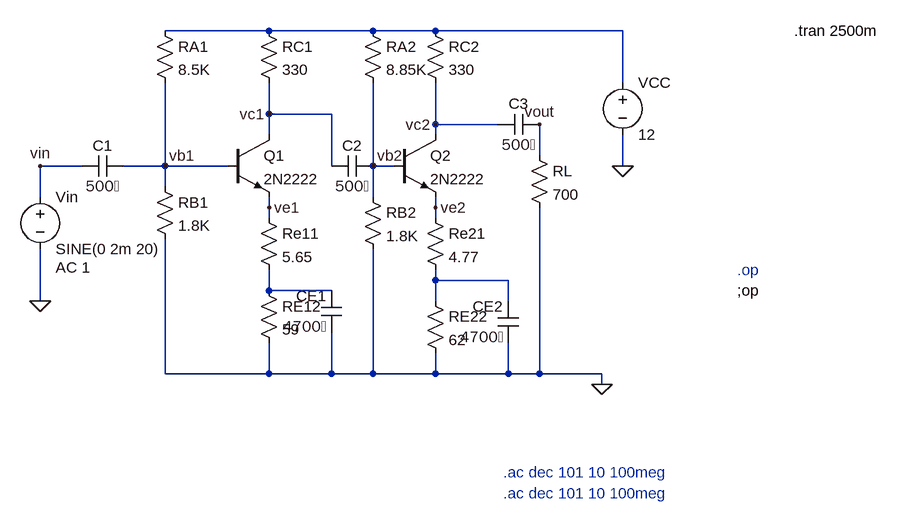
[diagram p0: schematic Draft3.asc]
Draft3.asc, the LTspice schematic file:
Version 4.1
SHEET 1 1200 680
WIRE 224 -48 64 -48
WIRE 384 -48 224 -48
WIRE 480 -48 384 -48
WIRE 768 -48 480 -48
WIRE 768 32 768 -48
WIRE 224 80 224 32
WIRE 320 80 224 80
WIRE 480 96 480 32
WIRE 576 96 480 96
WIRE 224 112 224 80
WIRE 480 112 480 96
WIRE 640 144 640 96
WIRE -64 160 -128 160
WIRE 64 160 64 32
WIRE 64 160 0 160
WIRE 160 160 64 160
WIRE 320 160 320 80
WIRE 384 160 384 32
WIRE 416 160 384 160
WIRE 768 160 768 112
WIRE 64 192 64 160
WIRE -128 208 -128 160
WIRE 384 208 384 160
WIRE 224 224 224 208
WIRE 480 224 480 208
WIRE 224 240 224 224
WIRE 480 240 480 224
WIRE 480 336 480 320
WIRE 592 336 480 336
WIRE 224 352 224 320
WIRE 320 352 224 352
WIRE -128 368 -128 288
WIRE 480 368 480 336
WIRE 592 368 592 336
WIRE 64 480 64 272
WIRE 224 480 224 432
WIRE 224 480 64 480
WIRE 320 480 320 416
WIRE 320 480 224 480
WIRE 384 480 384 288
WIRE 384 480 320 480
WIRE 480 480 480 448
WIRE 480 480 384 480
WIRE 592 480 592 432
WIRE 592 480 480 480
WIRE 640 480 640 224
WIRE 640 480 592 480
WIRE 736 480 640 480
WIRE 736 496 736 480
FLAG 768 160 0
FLAG 736 496 0
FLAG -128 368 0
FLAG 480 224 ve2
FLAG 480 96 vc2
FLAG 224 80 vc1
FLAG 224 224 ve1
FLAG 384 160 vb2
FLAG 64 160 vb1
FLAG -128 160 vin
FLAG 640 96 vout
SYMBOL npn 160 112 R0
SYMATTR InstName Q1
SYMATTR Value 2N2222
SYMBOL res 208 -64 R0
SYMATTR InstName RC1
SYMATTR Value 330
SYMBOL res 208 224 R0
SYMATTR InstName Re11
SYMATTR Value 5.65
SYMBOL res 208 336 R0
SYMATTR InstName RE12
SYMATTR Value 59
SYMBOL res 48 176 R0
SYMATTR InstName RB1
SYMATTR Value 1.8K
SYMBOL res 48 -64 R0
SYMATTR InstName RA1
SYMATTR Value 8.5K
SYMBOL res 368 -64 R0
SYMATTR InstName RA2
SYMATTR Value 8.85K
SYMBOL res 368 192 R0
SYMATTR InstName RB2
SYMATTR Value 1.8K
SYMBOL npn 416 112 R0
SYMATTR InstName Q2
SYMATTR Value 2N2222
SYMBOL res 464 -64 R0
SYMATTR InstName RC2
SYMATTR Value 330
SYMBOL res 464 224 R0
SYMATTR InstName Re21
SYMATTR Value 4.77
SYMBOL res 464 352 R0
SYMATTR InstName RE22
SYMATTR Value 62
SYMBOL cap 384 144 R90
WINDOW 0 0 32 VBottom 2
WINDOW 3 32 32 VTop 2
SYMATTR InstName C2
SYMATTR Value 500�
SYMBOL cap 640 80 R90
WINDOW 0 0 32 VBottom 2
WINDOW 3 32 32 VTop 2
SYMATTR InstName C3
SYMATTR Value 500�
SYMBOL cap 608 432 R180
WINDOW 0 24 56 Left 2
WINDOW 3 24 8 Left 2
SYMATTR InstName CE2
SYMATTR Value 4700�
SYMBOL cap 336 416 R180
WINDOW 0 24 56 Left 2
WINDOW 3 24 8 Left 2
SYMATTR InstName CE1
SYMATTR Value 4700�
SYMBOL cap -64 176 R270
WINDOW 0 32 32 VTop 2
WINDOW 3 0 32 VBottom 2
SYMATTR InstName C1
SYMATTR Value 500�
SYMBOL res 624 128 R0
SYMATTR InstName RL
SYMATTR Value 700
SYMBOL voltage 768 16 R0
SYMATTR InstName VCC
SYMATTR Value 12
SYMBOL voltage -128 192 R0
WINDOW 123 24 124 Left 2
WINDOW 39 0 0 Left 0
SYMATTR Value2 AC 1
SYMATTR InstName Vin
SYMATTR Value SINE(0 2m 20)
TEXT 584 632 Left 2 ;.ac dec 101 10 100meg
TEXT 944 320 Left 2 ;.op
TEXT 584 664 Left 2 ;.ac dec 101 10 100meg
TEXT 944 352 Left 2 !;op
TEXT 1032 -48 Left 2 !.tran 2500m

The netlist it stands for:
* Draft3.asc
Q1 vc1 vb1 ve1 0 2N2222
RC1 N001 vc1 330
Re11 ve1 N003 5.65
RE12 N003 0 59
RB1 vb1 0 1.8K
RA1 N001 vb1 8.5K
RA2 N001 vb2 8.85K
RB2 vb2 0 1.8K
Q2 vc2 vb2 ve2 0 2N2222
RC2 N001 vc2 330
Re21 ve2 N002 4.77
RE22 N002 0 62
C2 vb2 vc1 500�
C3 vout vc2 500�
CE2 0 N002 4700�
CE1 0 N003 4700�
C1 vin vb1 500�
RL vout 0 700
VCC N001 0 12
Vin vin 0 SINE(0 2m 20) AC 1
.model NPN NPN
.model PNP PNP
.lib standard.bjt
* .ac dec 101 10 100meg
* .op
* .ac dec 101 10 100meg
;op
.tran 2500m
.backanno
.end